# Altium schematic sheet Sheet2.SchDoc
size A2
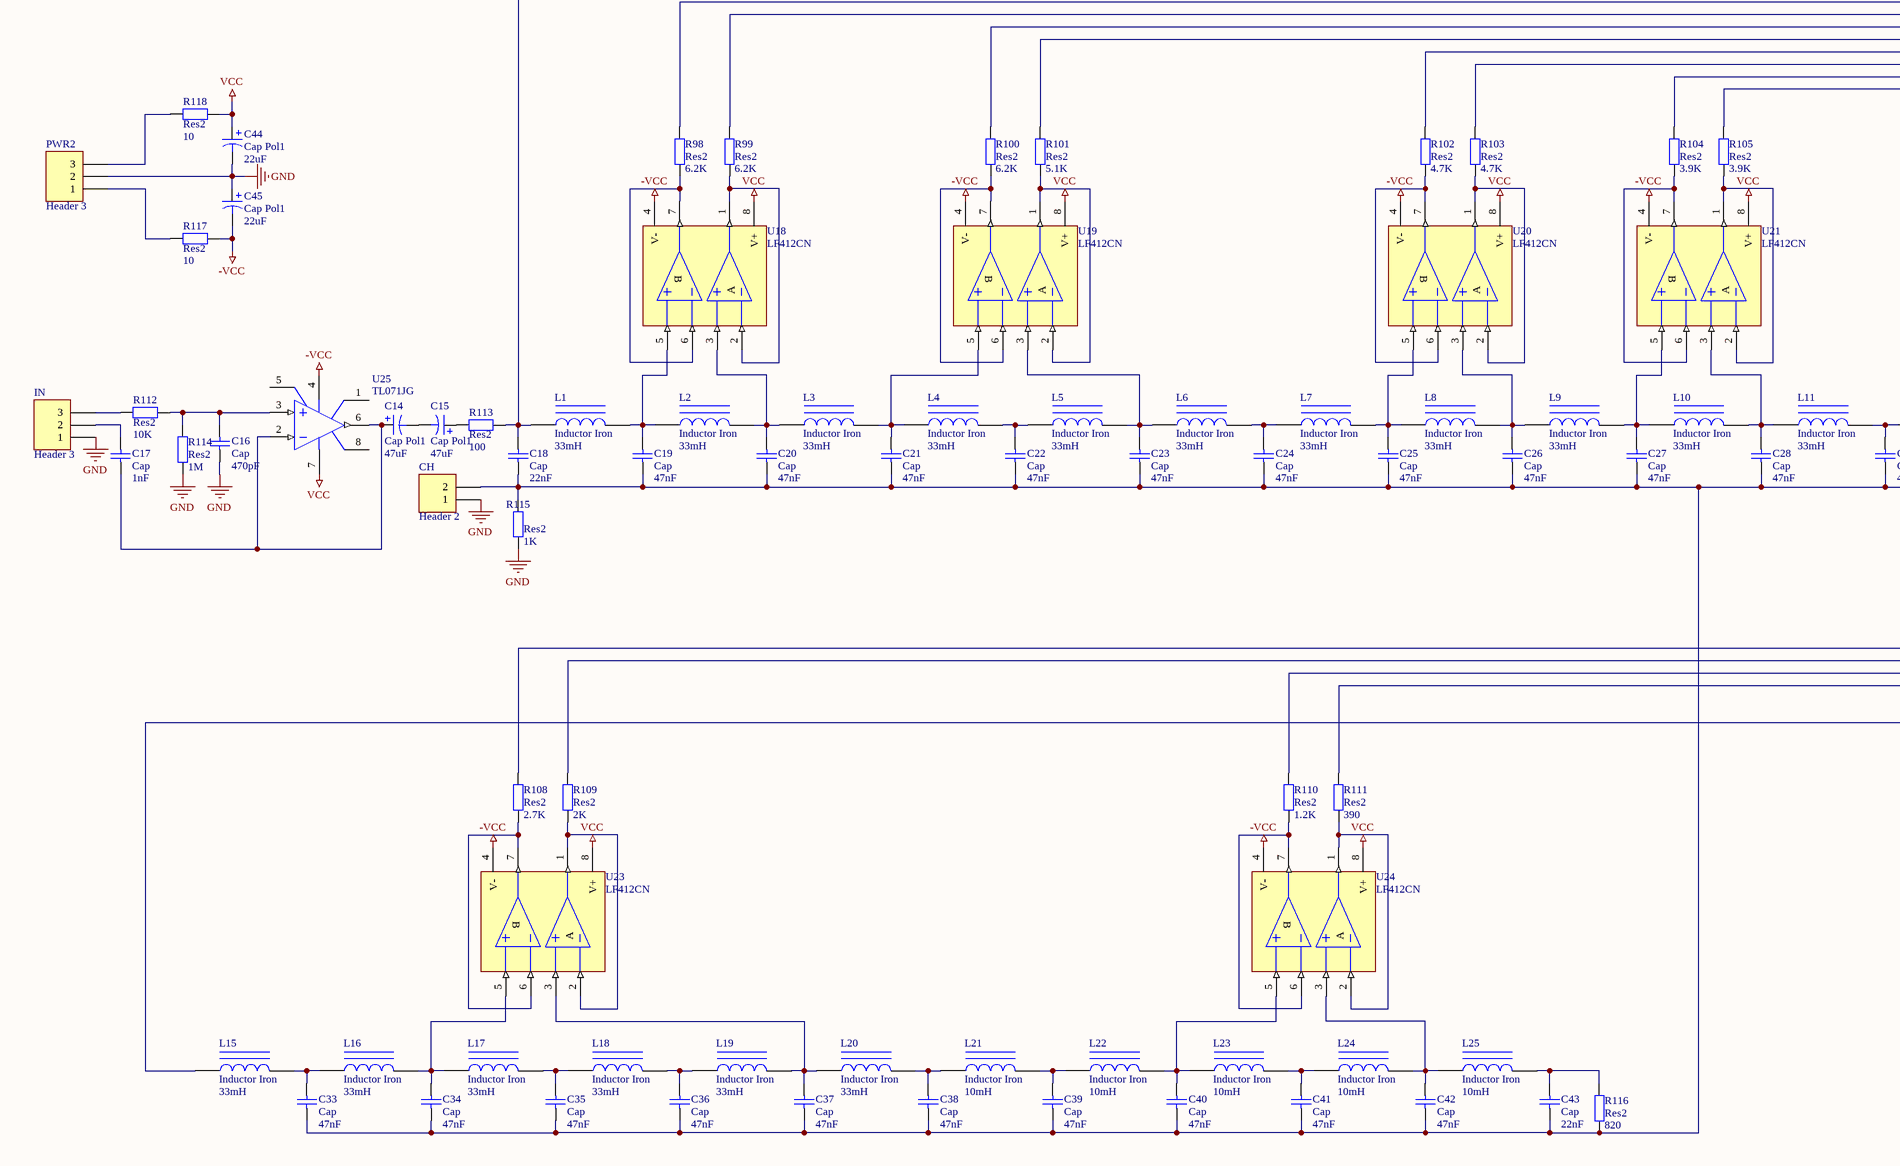
[diagram p0: Sheet2.SchDoc, left]
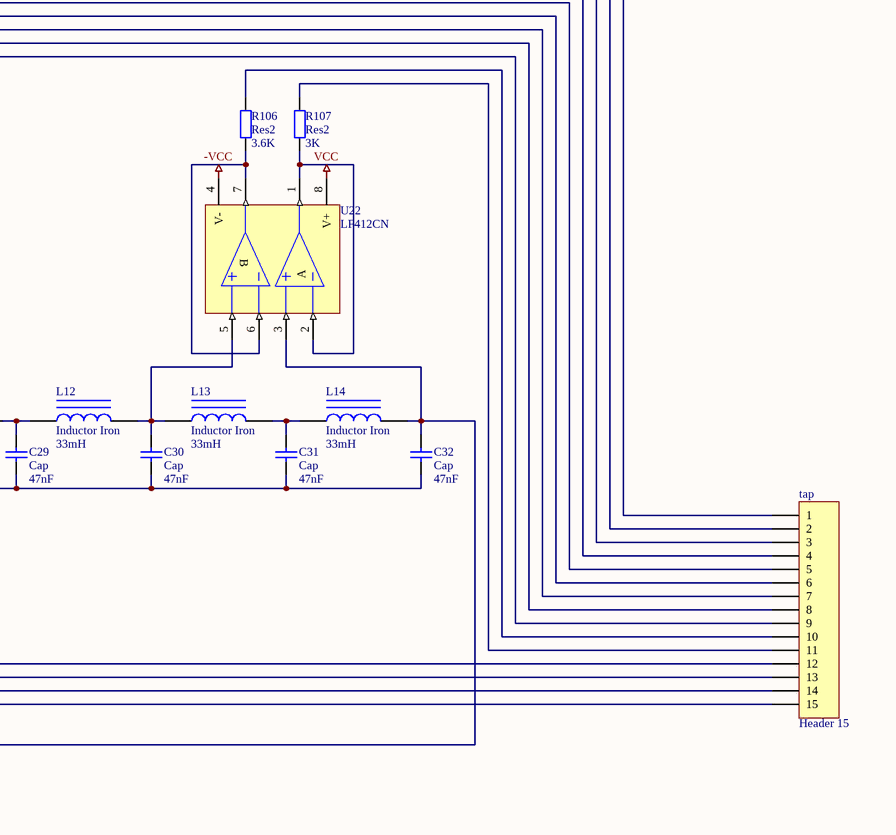
[diagram p1: Sheet2.SchDoc, right]

## Parts
C14  Cap Pol1  value 47uF  [B]
C15  Cap Pol1  value 47uF  [B]
C16  Cap  value 470pF  [VP45-3.2]
C17  Cap  value 1nF  [VP45-3.2]
C18  Cap  value 22nF  [VP45-3.2]
C19  Cap  value 47nF  [VP45-3.2]
C20  Cap  value 47nF  [VP45-3.2]
C21  Cap  value 47nF  [VP45-3.2]
C22  Cap  value 47nF  [VP45-3.2]
C23  Cap  value 47nF  [VP45-3.2]
C24  Cap  value 47nF  [VP45-3.2]
C25  Cap  value 47nF  [VP45-3.2]
C26  Cap  value 47nF  [VP45-3.2]
C27  Cap  value 47nF  [VP45-3.2]
C28  Cap  value 47nF  [VP45-3.2]
C29  Cap  value 47nF  [VP45-3.2]
C30  Cap  value 47nF  [VP45-3.2]
C31  Cap  value 47nF  [VP45-3.2]
C32  Cap  value 47nF  [VP45-3.2]
C33  Cap  value 47nF  [VP45-3.2]
C34  Cap  value 47nF  [VP45-3.2]
C35  Cap  value 47nF  [VP45-3.2]
C36  Cap  value 47nF  [VP45-3.2]
C37  Cap  value 47nF  [VP45-3.2]
C38  Cap  value 47nF  [VP45-3.2]
C39  Cap  value 47nF  [VP45-3.2]
C40  Cap  value 47nF  [VP45-3.2]
C41  Cap  value 47nF  [VP45-3.2]
C42  Cap  value 47nF  [VP45-3.2]
C43  Cap  value 22nF  [VP45-3.2]
C44  Cap Pol1  value 22uF  [B]
C45  Cap Pol1  value 22uF  [B]
CH  Header 2  [HDR1X2]
IN  Header 3  [HDR1X3]
L1  Inductor Iron  value 33mH  [AXIAL-0.9]
L2  Inductor Iron  value 33mH  [AXIAL-0.9]
L3  Inductor Iron  value 33mH  [AXIAL-0.9]
L4  Inductor Iron  value 33mH  [AXIAL-0.9]
L5  Inductor Iron  value 33mH  [AXIAL-0.9]
L6  Inductor Iron  value 33mH  [AXIAL-0.9]
L7  Inductor Iron  value 33mH  [AXIAL-0.9]
L8  Inductor Iron  value 33mH  [AXIAL-0.9]
L9  Inductor Iron  value 33mH  [AXIAL-0.9]
L10  Inductor Iron  value 33mH  [AXIAL-0.9]
L11  Inductor Iron  value 33mH  [AXIAL-0.9]
L12  Inductor Iron  value 33mH  [AXIAL-0.9]
L13  Inductor Iron  value 33mH  [AXIAL-0.9]
L14  Inductor Iron  value 33mH  [AXIAL-0.9]
L15  Inductor Iron  value 33mH  [AXIAL-0.9]
L16  Inductor Iron  value 33mH  [AXIAL-0.9]
L17  Inductor Iron  value 33mH  [AXIAL-0.9]
L18  Inductor Iron  value 33mH  [AXIAL-0.9]
L19  Inductor Iron  value 33mH  [AXIAL-0.9]
L20  Inductor Iron  value 33mH  [AXIAL-0.9]
L21  Inductor Iron  value 10mH  [AXIAL-0.9]
L22  Inductor Iron  value 10mH  [AXIAL-0.9]
L23  Inductor Iron  value 10mH  [AXIAL-0.9]
L24  Inductor Iron  value 10mH  [AXIAL-0.9]
L25  Inductor Iron  value 10mH  [AXIAL-0.9]
PWR2  Header 3  [HDR1X3]
R98  Res2  value 6.2K  [AXIAL-0.4]
R99  Res2  value 6.2K  [AXIAL-0.4]
R100  Res2  value 6.2K  [AXIAL-0.4]
R101  Res2  value 5.1K  [AXIAL-0.4]
R102  Res2  value 4.7K  [AXIAL-0.4]
R103  Res2  value 4.7K  [AXIAL-0.4]
R104  Res2  value 3.9K  [AXIAL-0.4]
R105  Res2  value 3.9K  [AXIAL-0.4]
R106  Res2  value 3.6K  [AXIAL-0.4]
R107  Res2  value 3K  [AXIAL-0.4]
R108  Res2  value 2.7K  [AXIAL-0.4]
R109  Res2  value 2K  [AXIAL-0.4]
R110  Res2  value 1.2K  [AXIAL-0.4]
R111  Res2  value 390  [AXIAL-0.4]
R112  Res2  value 10K  [AXIAL-0.4]
R113  Res2  value 100  [AXIAL-0.4]
R114  Res2  value 1M  [AXIAL-0.4]
R115  Res2  value 1K  [AXIAL-0.4]
R116  Res2  value 820  [AXIAL-0.4]
R117  Res2  value 10  [AXIAL-0.4]
R118  Res2  value 10  [AXIAL-0.4]
tap  Header 15  [HDR1X15]
U18  LF412CN  [N08E]
U19  LF412CN  [N08E]
U20  LF412CN  [N08E]
U21  LF412CN  [N08E]
U22  LF412CN  [N08E]
U23  LF412CN  [N08E]
U24  LF412CN  [N08E]
U25  TL071JG  [JG008]

## Nets
-VCC: C45.2 R117.1 U18.4(V-) U19.4(V-) U20.4(V-) U21.4(V-) U22.4(V-) U23.4(V-) U24.4(V-) U25.4(V-)
GND: C16.1 C44.2 C45.1 CH.1 IN.1 PWR2.2 R114.1 R115.1
VCC: C44.1 R118.1 U18.8(V+) U19.8(V+) U20.8(V+) U21.8(V+) U22.8(V+) U23.8(V+) U24.8(V+) U25.7(V+)
NetC14_1: C14.1 C17.1 U25.2(IN-) U25.6(OUT)
NetC14_2: C14.2 C15.2
NetC15_1: C15.1 R113.1
NetC16_2: C16.2 R112.1 R114.2 U25.3(IN+)
NetC17_2: C17.2 IN.2
NetC18_1: C18.1 C19.1 C20.1 C21.1 C22.1 C23.1 C24.1 C25.1 C26.1 C27.1 C28.1 C29.1 C30.1 C31.1 C32.1 C33.1 C34.1 C35.1 C36.1 C37.1 C38.1 C39.1 C40.1 C41.1 C42.1 C43.1 CH.2 R115.2 R116.1
NetC18_2: C18.2 L1.1 R113.2 tap.1
NetC19_2: C19.2 L1.2 L2.1 U18.5(INB+)
NetC20_2: C20.2 L2.2 L3.1 U18.3(INA+)
NetC21_2: C21.2 L3.2 L4.1 U19.5(INB+)
NetC22_2: C22.2 L4.2 L5.1
NetC23_2: C23.2 L5.2 L6.1 U19.3(INA+)
NetC24_2: C24.2 L6.2 L7.1
NetC25_2: C25.2 L7.2 L8.1 U20.5(INB+)
NetC26_2: C26.2 L8.2 L9.1 U20.3(INA+)
NetC27_2: C27.2 L9.2 L10.1 U21.5(INB+)
NetC28_2: C28.2 L10.2 L11.1 U21.3(INA+)
NetC29_2: C29.2 L11.2 L12.1
NetC30_2: C30.2 L12.2 L13.1 U22.5(INB+)
NetC31_2: C31.2 L13.2 L14.1
NetC32_2: C32.2 L14.2 L15.1 U22.3(INA+)
NetC33_2: C33.2 L15.2 L16.1
NetC34_2: C34.2 L16.2 L17.1 U23.5(INB+)
NetC35_2: C35.2 L17.2 L18.1
NetC36_2: C36.2 L18.2 L19.1
NetC37_2: C37.2 L19.2 L20.1 U23.3(INA+)
NetC38_2: C38.2 L20.2 L21.1
NetC39_2: C39.2 L21.2 L22.1
NetC40_2: C40.2 L22.2 L23.1 U24.5(INB+)
NetC41_2: C41.2 L23.2 L24.1
NetC42_2: C42.2 L24.2 L25.1 U24.3(INA+)
NetC43_2: C43.2 L25.2 R116.2
NetIN_3: IN.3 R112.2
NetPWR2_1: PWR2.1 R117.2
NetPWR2_3: PWR2.3 R118.2
NetR98_1: R98.1 U18.6(INB-) U18.7(OUTB)
NetR98_2: R98.2 tap.2
NetR99_1: R99.1 U18.1(OUTA) U18.2(INA-)
NetR99_2: R99.2 tap.3
NetR100_1: R100.1 U19.6(INB-) U19.7(OUTB)
NetR100_2: R100.2 tap.4
NetR101_1: R101.1 U19.1(OUTA) U19.2(INA-)
NetR101_2: R101.2 tap.5
NetR102_1: R102.1 U20.6(INB-) U20.7(OUTB)
NetR102_2: R102.2 tap.6
NetR103_1: R103.1 U20.1(OUTA) U20.2(INA-)
NetR103_2: R103.2 tap.7
NetR104_1: R104.1 U21.6(INB-) U21.7(OUTB)
NetR104_2: R104.2 tap.8
NetR105_1: R105.1 U21.1(OUTA) U21.2(INA-)
NetR105_2: R105.2 tap.9
NetR106_1: R106.1 U22.6(INB-) U22.7(OUTB)
NetR106_2: R106.2 tap.10
NetR107_1: R107.1 U22.1(OUTA) U22.2(INA-)
NetR107_2: R107.2 tap.11
NetR108_1: R108.1 U23.6(INB-) U23.7(OUTB)
NetR108_2: R108.2 tap.12
NetR109_1: R109.1 U23.1(OUTA) U23.2(INA-)
NetR109_2: R109.2 tap.13
NetR110_1: R110.1 U24.6(INB-) U24.7(OUTB)
NetR110_2: R110.2 tap.14
NetR111_1: R111.1 U24.1(OUTA) U24.2(INA-)
NetR111_2: R111.2 tap.15

Not connected (* = marked no-connect by the designer): U25 1(OS_TRIM) 5(OS_TRIM) 8(NC)

## Notes on the sheet
- (in symbol LF412CN) B; A

## Library data of the parts
C14 C15 C44 C45 = Cap Pol1: Polarized Capacitor (Radial); Published: 8-Jun-2000; LatestRevisionDate: 17-Jul-2002; LatestRevisionNote: Re-released for DXP Platform.; PackageReference: RB7.6-15; Publisher: Altium Limited
C16-C43 = Cap: Capacitor; Published: 8-Jun-2000; LatestRevisionDate: 17-Jul-2002; LatestRevisionNote: Re-released for DXP Platform.; PackageReference: RAD-0.3; Publisher: Altium Limited
CH = Header 2: Header, 2-Pin; LatestRevisionDate: 17-Jul-2002; LatestRevisionNote: Re-released for DXP Platform.; Publisher: Altium Limited
IN PWR2 = Header 3: Header, 3-Pin; LatestRevisionDate: 17-Jul-2002; LatestRevisionNote: Re-released for DXP Platform.; Publisher: Altium Limited
L1-L25 = Inductor Iron: Magnetic-Core Inductor; Published: 24-Mar-1999; LatestRevisionDate: 17-Jul-2002; LatestRevisionNote: Re-released for DXP Platform.; PackageReference: AXIAL-0.9; Publisher: Altium Limited
R98-R118 = Res2: Resistor; Published: 8-Jun-2000; LatestRevisionDate: 17-Jul-2002; LatestRevisionNote: Re-released for DXP Platform.; PackageReference: AXIAL-0.4; Publisher: Altium Limited
tap = Header 15: Header, 15-Pin; LatestRevisionDate: 17-Jul-2002; LatestRevisionNote: Re-released for DXP Platform.; Publisher: Altium Limited
U18-U24 = LF412CN: Low Offset, Low Drift Dual JFET Input Operational Amplifier; Manufacturer: National Semiconductor; CompType: Amplifiers; PackageTopMarking: NSUZXYTT*LF*412CN; Published: 27-Nov-2008; DatasheetVersion: Aug-2000; PackageVersion: revG, May-2006; PackageReference: N08E; Publisher: Altium Limited; PackageDescription: MDIP, .365 x .250 x .130in, 8 Lead, .100in Pitch; PartNumber: LF412CN; RoHS: O; PinCount: 8; DigiKeyPartNumber: LF412CN-ND; Code_JEDEC: MS-001-BA; ComponentLink1Description: LF412 Datasheet; ComponentLink1URL: http://www.national.com/ds/LF/LF412.pdf; ComponentLink2Description: LF412 Web Page; ComponentLink2URL: http://www.national.com/pf/LF/LF412.html; ComponentLink3Description: N08E Package Page; ComponentLink3URL: http://www.national.com/packaging/folders/n08e.html
U25 = TL071JG: Low-Noise JFET-Input Operational Amplifier; Note: Pin 8 is not connected; Published: 16-Jan-2001; LatestRevisionDate: 04-Mar-2005; LatestRevisionNote: Stylized 3D Model Added.; DatasheetVersion: Aug-1996; PackageVersion: Jan-1995; PackageReference: JG008; Publisher: Altium Limited; PackageDescription: DIP; 8 Leads; Row Spacing 7.62 mm; Pitch 2.54 mm; ComponentLink1Description: Manufacturer Link; ComponentLink1URL: http://www.ti.com/; ComponentLink2Description: Datasheet; ComponentLink2URL: http://www-s.ti.com/sc/ds/tl071.pdf